# EasyEDA Pro project 24Vto12V_v2_1_2025-04-05_21-50-08.eprj

# Schematic Schematic1
Board Name: Board1; Create Date: 2025-04-05; Page Name: P1; Project Name: 24Vto12V_v2_1_2025-04-05_21-50-08; Schematic Name: Schematic1; Update Date: 2025-04-05; Company: 嘉立创EDA; Drawed: 王大智; Page Size: A4; Version: V1.0
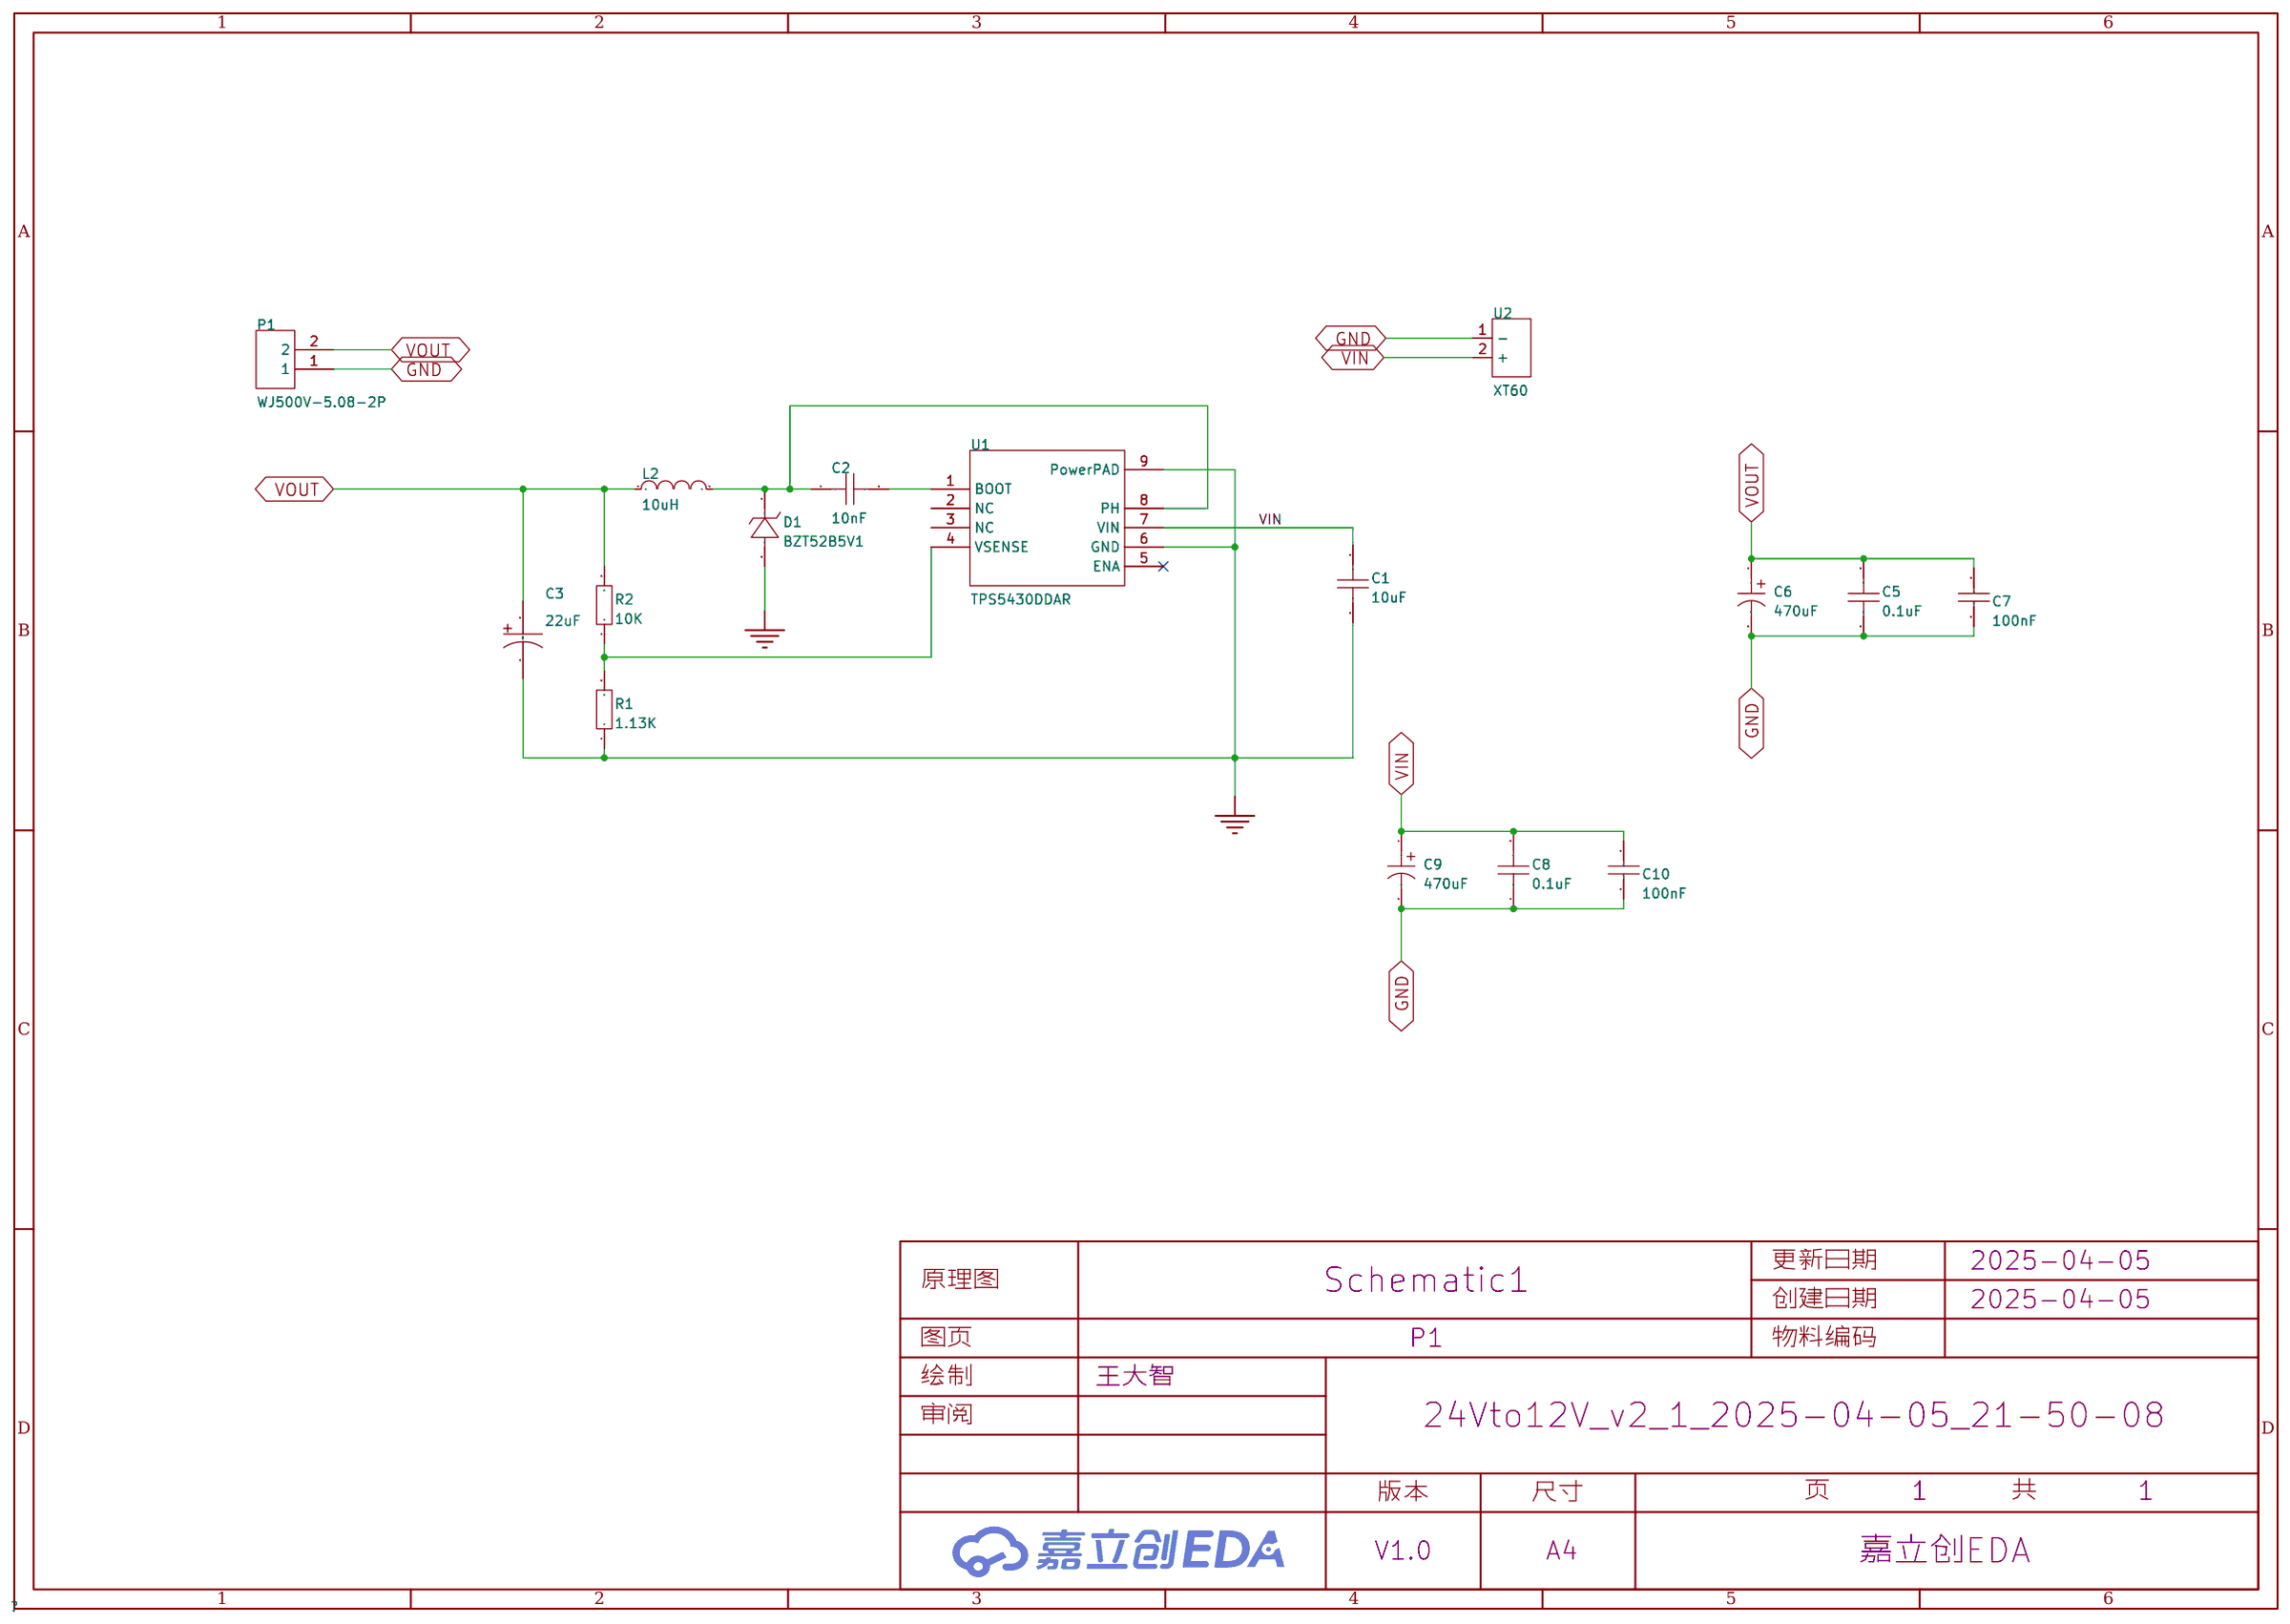
[diagram p0: schematic sheet]

## Parts
C1  10uF  [C0603]
C2  10nF  [C0603]
C3  22uF  [CAP-SMD_L3.5-W2.8-R-RD]
C5  0.1uF  [C0603]
C6  470uF  [CAP-TH_BD8.0-P3.50-D0.6-FD_1]
C7  100nF  [CAP-TH_L8.5-W5.0-P5.00-D1.2]
C8  0.1uF  [C0603]
C9  470uF  [CAP-TH_BD8.0-P3.50-D0.6-FD_1]
C10  100nF  [CAP-TH_L8.5-W5.0-P5.00-D1.2]
D1  BZT52B5V1  [SOD-123_L2.7-W1.6-LS3.7-RD]
L2  10uH  [IND-SMD_L11.5-W10.0_MCF-1050]
P1  WJ500V-5.08-2P  [CONN-TH_2P-P5.00_WJ500V-5.08-2P]
R1  1.13K  [R0603]
R2  10K  [R0603]
U1  TPS5430DDAR  [ESOP-8_L4.9-W3.9-P1.27-LS6.0-TL-EP]
U2  XT60  [CONN-TH_XT60]

## Library data of the parts
C1 C2 C5 C8 = CAP_0603: Supplier Footprint: 0603
C3 = TPSB226K020R0400: 容值:22uF;精度:±10%;额定电压:20V;等效串联电阻:400mΩ@100kHz;; LCSC Part Name: 22uF ±10% 20V; Supplier Part: C308917; Manufacturer: Kyocera AVX; Supplier Footprint: CASE-B-3528-21(mm); JLCPCB Part Class: 扩展库; Datasheet: https://atta.szlcsc.com/upload/public/pdf/source/20190626/C400103_28AE209020E7532C1D8166E9B4B580CB.pdf; Supplier: LCSC; Tolerance: ±10%; Rated Voltage: 20V; Equivalent Series Resistance(ESR): 400mΩ@100kHz; Operating Temperature: -55℃~+125℃
C6 C9 = CD2884771EM0812VFL: 容值:470uF;额定电压:25V;; LCSC Part Name: 470uF 25V; Supplier Part: C2960233; Manufacturer: HRK(鸿瑞凯电子); Supplier Footprint: 插件,D8xL12mm; JLCPCB Part Class: 扩展库; Datasheet: https://atta.szlcsc.com/upload/public/pdf/source/20240703/D49961C1CEC6E325964F7113D69E9087.pdf; Supplier: LCSC; Rated Voltage: 25V; φD: 8mm; L: 12mm; Operating Temperature: -40℃~+105℃
C7 C10 = CT4-0805Y104M500F3: 容值:100nF;精度:±20%;额定电压:50V;温度系数:Y5V;; LCSC Part Name: 100nF ±20% 50V; Supplier Part: C94717; Manufacturer: FH(风华); Supplier Footprint: 插件,P=5.08mm; JLCPCB Part Class: 扩展库; Datasheet: https://atta.szlcsc.com/upload/public/pdf/source/20190402/C385200_059806A6312B28FF1421A2413EB641E1.pdf; Supplier: LCSC; Tolerance: ±20%; Voltage Rated: 50V; Temperature Coefficient: Y5V
D1 = BZT52B5V1_C19077393: 二极管配置:独立式;稳压值(标称值):5.1V;稳压值(范围):5V~5.2V;耗散功率(Pd):500mW;; Supplier Part: C19077393; Manufacturer: 宏嘉诚; Supplier Footprint: SOD-123; JLCPCB Part Class: 扩展库; Datasheet: https://atta.szlcsc.com/upload/public/pdf/source/20250106/AFD01FE5B0C707EDCEE558C585303F64.pdf; Supplier: LCSC; Diode Configuration: 独立式; Zener Voltage(Nom): 5.1V; Reverse Leakage Current (Ir): 2uA@2V; Zener Voltage(Range): 5V~5.2V; Pd - Power Dissipation(Pd): 500mW; Impedance(Zzt): 60Ω
L2 = MS1040-100M: LCSC Part Name: 10uH ±20%; Supplier Part: C380052; Manufacturer: COILMX(迈翔科技); Supplier Footprint: SMD; JLCPCB Part Class: 扩展库; Datasheet: https://atta.szlcsc.com/upload/public/pdf/source/20190509/C380060_C480BF6C9DDC75EDE5BB1ABE1C0858F7.pdf; Supplier: LCSC; Tolerance: ±20%; Rated Current: 5.5A; DC Resistance (DCR): 27mΩ
P1 = WJ500V-5.08-2P: 结构:1x2P;间距:5.08mm;颜色:绿色;安装方式:直插;额定电流:18A;额定电压:250V;排数:1;线规 - AWG:14~30;线规 - 平方毫米:2.5;每排PIN数:2;触头材质:-;触头镀层:-;工作温度范围:-40℃~+105℃;焊接温度(最大值):-;; LCSC Part Name: 1x2P 5.08mm 直插 排数:1 每排P数:2; Supplier Part: C8465; Manufacturer: KANGNEX(康奈克斯电气); Supplier Footprint: 插件,P=5.08mm; JLCPCB Part Class: 扩展库; Datasheet: https://atta.szlcsc.com/upload/public/pdf/source/20191225/C8465_02D34CE5B5B4A53DF5891601D97FA9F4.pdf; Supplier: LCSC; Structure: 1x2P; Pitch: 5.08mm; Color: 绿色; Mounting Style: 直插; Current Rating (Max): 18A; Voltage Rating (Max): 250V; Number of Pins: 2P; Number of Rows: 1; Wire Gauge - AWG: 14~30; Wire Gauge - mm2: 2.5; Number of PINs Per Row: 2; Operating Temperature Range: -40℃~+105℃; Screw Specification: M2.5
R1 R2 = Res_0603: Supplier Footprint: 0603
U1 = TPS5430DDAR: 功能类型:降压型;输出类型:可调;工作电压:5.5V~36V;输出电压:1.221V~32.04V;输出电流:3A;; LCSC Part Name: 宽输入范围、3A输出电流的降压转换器; Supplier Part: C9864; Manufacturer: TI(德州仪器); Supplier Footprint: SOIC-8-EP; JLCPCB Part Class: 基础库; Datasheet: https://www.ti.com/cn/lit/gpn/tps5430; Supplier: LCSC; Function: 降压型; Output Type: 可调; Input Voltage: 5.5V~36V; Output Voltage: 1.221V~32.04V; Output Current: 3A; Switching Frequency: 500kHz; Operating Temperature: -40℃~+125℃@(TJ); Synchronous Rectification: 否; Number of Outputs: 1; Topology: 降压式; Switch tube (built-in/external): 内置
U2 = XT60: 类别:-;类型1:-;; LCSC Part Name: AMASS(艾迈斯) XT60模型插头 3.5mm镀金香蕉头公头（电调端）XT60-M; Supplier Part: C98733; Manufacturer: AMASS(艾迈斯); JLCPCB Part Class: 扩展库; Datasheet: https://atta.szlcsc.com/upload/public/pdf/source/20170606/1496716524919.pdf; Supplier: LCSC; Brand: 艾迈斯; Type: 香蕉头; Colour: 黄色; InterfaceType: 公头; specifications: 3.5mm

## Nets
GND: C1.1 C3.2 C5.1 C6.2 C7.1 C8.1 C9.2 C10.1 D1.2(A) P1.1 R1.1 U1.6(GND) U1.9(PowerPAD) U2.1(-)
VIN: C1.2 C8.2 C9.1 C10.2 U1.7(VIN) U2.2(+)
VOUT: C3.1 C5.2 C6.1 C7.2 L2.1 P1.2 R2.2
$1N699: C2.2 U1.1(BOOT)
$1N700: C2.1 D1.1(K) L2.2 U1.8(PH)
$1N702: R1.2 R2.1 U1.4(VSENSE)

Not connected (* = marked no-connect by the designer): U1 2(NC) 3(NC) 5(ENA)*

# Board PCB1
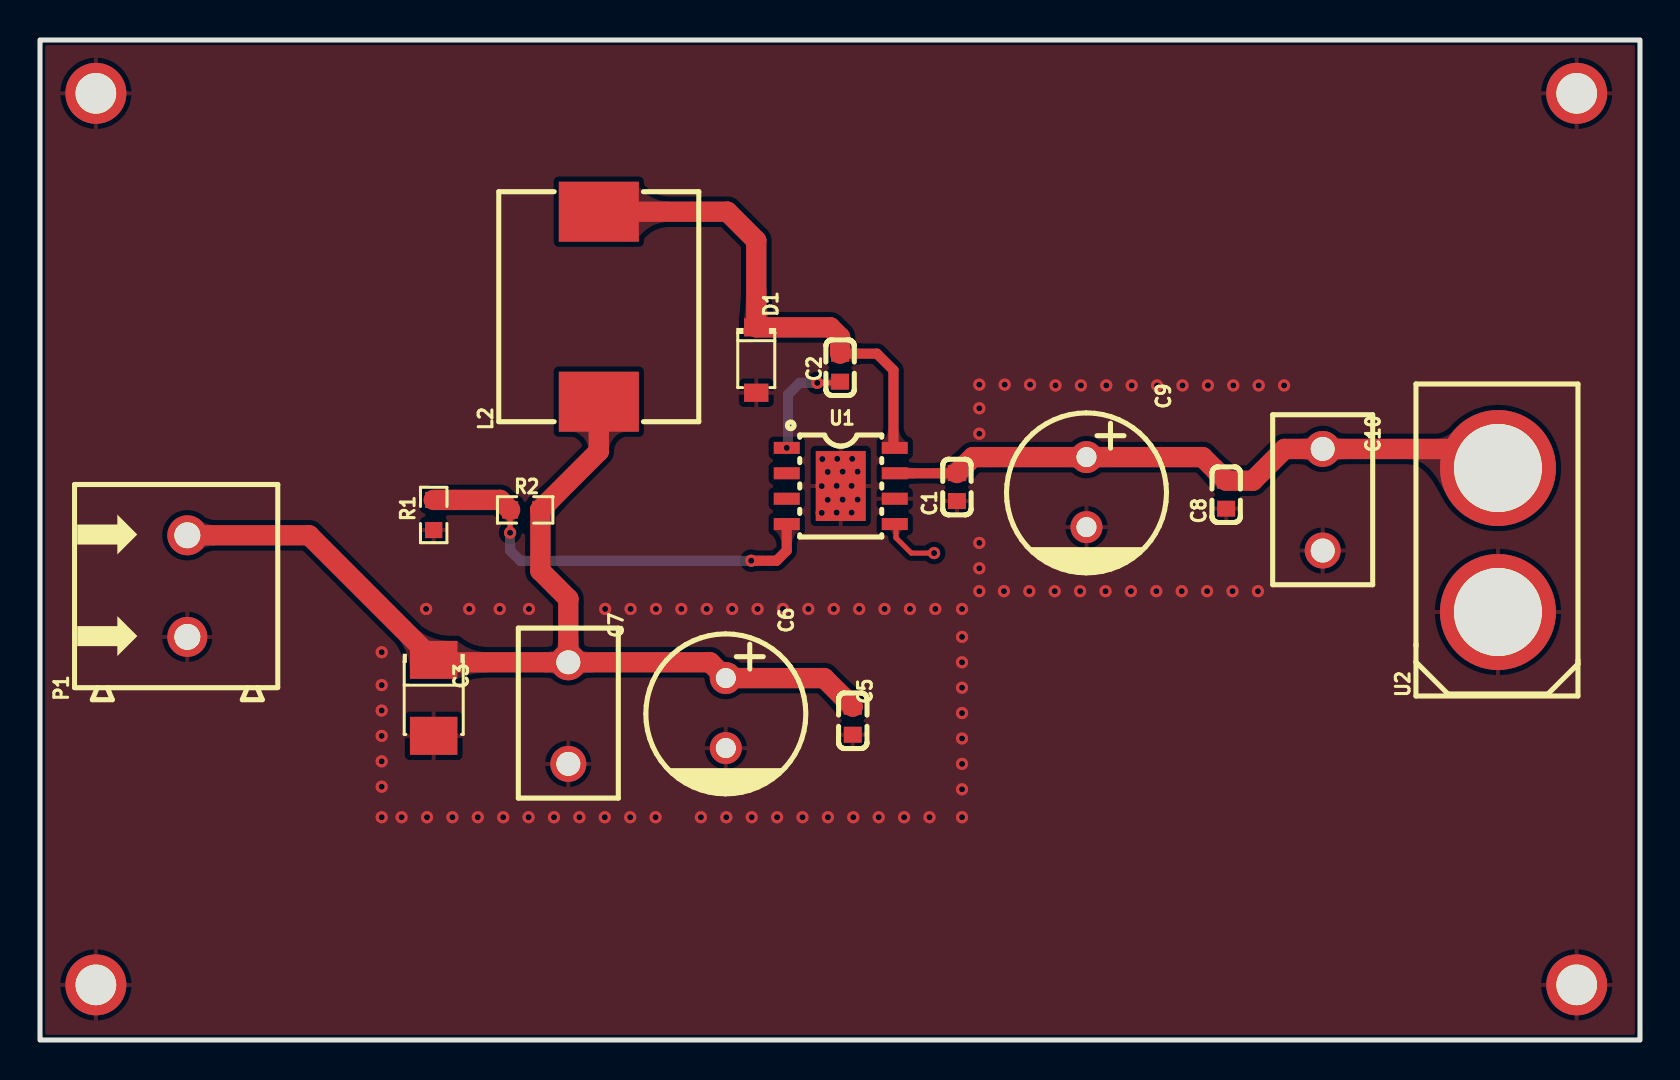
[diagram p1: board, top side]
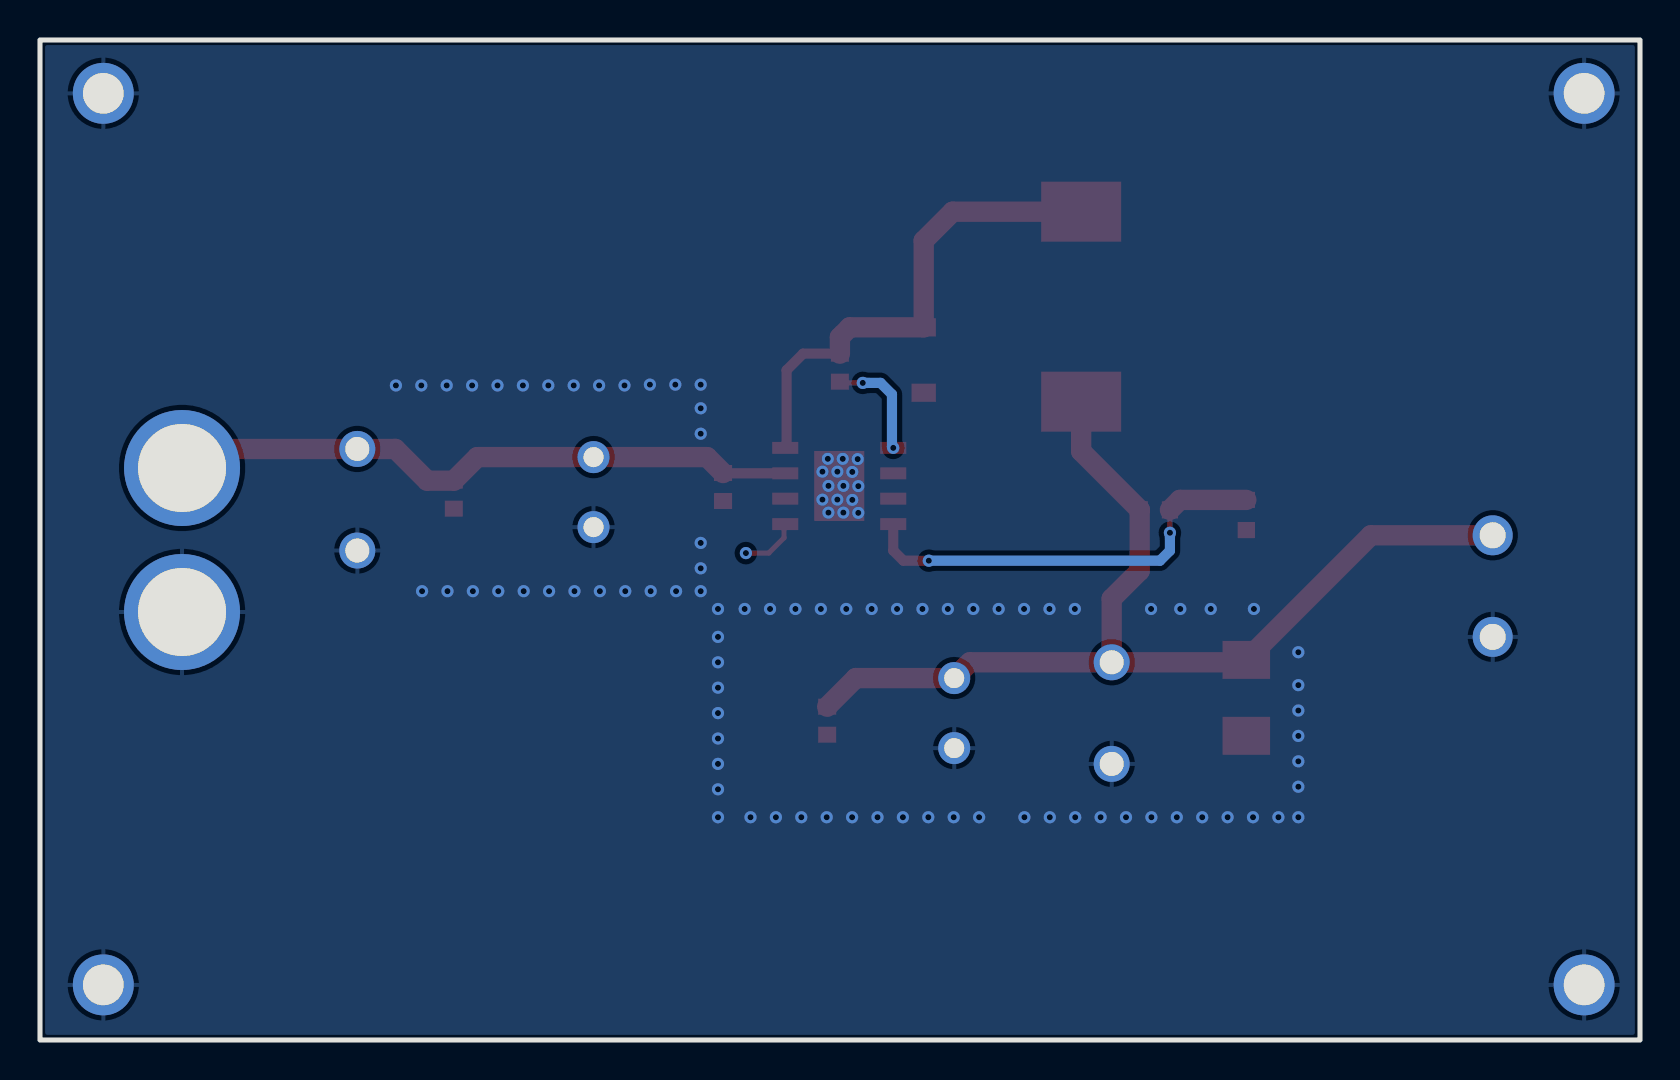
[diagram p2: board, bottom side, seen from below]

Outline 80 x 50 mm; copper layers: Top Layer, Bottom Layer. Coordinates in mm from the lower left corner of the outline.
Outline path: rectangle 0,50 80,0
Stack: Top Layer 0.035mm / Dielectric1 1.51mm FR4 er 4.5 / Bottom Layer 0.035mm

## Design rules (mm)
template: JLCPCB Capability(Two Layers Board)
spacing copperThickness1oz (default): track to track 0.102, other pairs 0.152 to 0.3
spacing copperThickness2oz: track to track 0.203, other pairs 0.152 to 0.3
track width copperThickness1oz (default): min 0.127, default 0.254, max 2.54
track width copperThickness2oz: min 0.203, default 0.254, max 2.54
differential pair differentialPair (default): width min 0.127, default 0.254, max 2.54; gap min 0.152, default 0.152
via viaSize (default): diameter min 0.5, default 0.61, max 10; hole min 0.3, default 0.305, max 6.3

## Placement (name value [footprint] x y rotation side)
C1  10uF  [C0603]  45.85 27.65 90 top
C2  10nF  [C0603]  40.01 33.62 270 top
C3  22uF  [CAP-SMD_L3.5-W2.8-R-RD]  19.69 17.11 90 top
C5  0.1uF  [C0603]  40.64 15.96 90 top
C6  470uF  [CAP-TH_BD8.0-P3.50-D0.6-FD_1]  34.29 16.34 270 top
C7  100nF  [CAP-TH_L8.5-W5.0-P5.00-D1.2]  26.42 16.34 90 top
C8  0.1uF  [C0603]  59.31 27.27 90 top
C9  470uF  [CAP-TH_BD8.0-P3.50-D0.6-FD_1]  52.32 27.39 270 top
C10  100nF  [CAP-TH_L8.5-W5.0-P5.00-D1.2]  64.14 27.01 90 top
D1  BZT52B5V1  [SOD-123_L2.7-W1.6-LS3.7-RD]  35.81 34 270 top
L2  10uH  [IND-SMD_L11.5-W10.0_MCF-1050]  27.94 36.67 90 top
NOREF  -  [Pad_e412]  76.83 2.76 0 top
NOREF#2  -  [Pad_e411]  2.79 2.76 0 top
NOREF#3  -  [Pad_e404]  2.79 47.33 0 top
NOREF#4  -  [Pad_e410]  76.83 47.33 0 top
P1  WJ500V-5.08-2P  [CONN-TH_2P-P5.00_WJ500V-5.08-2P]  7.37 22.7 90 top
R1  1.13K  [R0603]  19.69 26.25 90 top
R2  10K  [R0603]  24.26 26.51 0 top
U1  TPS5430DDAR  [ESOP-8_L4.9-W3.9-P1.27-LS6.0-TL-EP]  40.04 27.7 0 top
U2  XT60  [CONN-TH_XT60]  72.9 25 90 top

## Footprints (pads in the part's own frame, mm; a bottom-side part is the same pattern mirrored in y, then rotated)
C0603
  rect 0.8x0.9 smd: 1(-0.7,0) 2(0.7,0)
CAP-SMD_L3.5-W2.8-R-RD
  rect 1.9x2.376 smd: 1(1.899,0) 2(-1.899,0)
CAP-TH_BD8.0-P3.50-D0.6-FD_1
  round 1.6 hole 1: 1(-1.75,0) 2(1.75,0)
CAP-TH_L8.5-W5.0-P5.00-D1.2
  round 1.8 hole 1.2: 1(-2.54,0) 2(2.54,0)
CONN-TH_2P-P5.00_WJ500V-5.08-2P
  round 2 hole 1.3: 1(-2.54,0) 2(2.54,0)
CONN-TH_XT60
  round 5.8 hole 4.4: 1(-3.6,0) 2(3.6,0)
ESOP-8_L4.9-W3.9-P1.27-LS6.0-TL-EP
  rect 1.3x0.6 smd: 1(-2.7,1.905) 2(-2.7,0.635) 3(-2.7,-0.635) 4(-2.7,-1.905) 5(2.7,-1.905) 6(2.7,-0.635) 7(2.7,0.635) 8(2.7,1.905)
  rect 2.5x3.5 smd: 9(0,0)
IND-SMD_L11.5-W10.0_MCF-1050
  rect 3x4 smd: 1(-4.75,0) 2(4.75,0)
Pad_e404
  round 3.048 hole 2.032: 1(0,0)
Pad_e410
  round 3.048 hole 2.032: 1(0,0)
Pad_e411
  round 3.048 hole 2.032: 1(0,0)
Pad_e412
  round 3.048 hole 2.032: 1(0,0)
R0603
  rect 0.806x0.864 smd: 1(-0.753,0) 2(0.753,0)
SOD-123_L2.7-W1.6-LS3.7-RD
  rect 0.91x1.22 smd: 1(-1.635,0) 2(1.635,0)

## Nets
As in the schematic, except:
GND: C1.1 C3.2 C5.1 C6.2 C7.1 C8.1 C9.2 C10.1 D1.2 NOREF.1 NOREF#2.1 NOREF#3.1 NOREF#4.1 P1.1 R1.1 U1.6 U1.9 U2.1

Pads without a net: U1 2 3

## Via types
v1: diameter 0.61, hole 0.305, Top Layer to Bottom Layer, 104 vias

## Routing (per net, layer and track width the routed paths; a pad name or vN(x,y) marks a point on that pad's centre or on a via; arc(x,y) is an arc through that point)
GND:
  vias: v1(17.08,19.39) v1(17.08,17.74) v1(17.08,16.47) v1(17.08,15.2) v1(17.08,13.93) v1(17.08,12.66) v1(17.08,11.14) v1(18.08,11.14) v1(19.3,21.55) v1(19.35,11.14) v1(20.62,11.14) v1(21.46,21.55) v1(21.89,11.14) v1(22.99,21.55) v1(23.16,11.14) v1(24.45,21.55) v1(24.43,11.14) v1(25.7,11.14) v1(26.97,11.14) v1(28.26,21.55) v1(28.24,11.14) v1(29.53,21.55) v1(29.51,11.14) v1(30.8,21.55) v1(30.78,11.14) v1(32.07,21.55) v1(33.05,11.14) v1(33.34,21.55) v1(34.32,11.14) v1(34.61,21.55) v1(35.58,11.14) v1(35.88,21.55) v1(36.86,11.14) v1(37.15,21.55) v1(38.13,11.14) v1(38.42,21.55) v1(39.09,27.69) v1(39.09,26.36) v1(39.12,29.05) v1(39.39,28.4) v1(39.39,27.01) v1(39.39,11.14) v1(39.69,21.55) v1(39.86,29.06) v1(39.83,27.71) v1(39.83,26.37) v1(40.13,28.42) v1(40.13,27.02) v1(40.58,27.71) v1(40.58,26.37) v1(40.61,29.06) v1(40.67,11.14) v1(40.88,28.42) v1(40.88,27.02) v1(40.96,21.55) v1(41.94,11.14) v1(42.23,21.55) v1(43.2,11.14) v1(43.5,21.55) v1(44.48,11.14) v1(44.77,21.55) v1(46.1,21.55) v1(46.1,20.16) v1(46.1,18.89) v1(46.1,17.62) v1(46.1,16.34) v1(46.1,15.08) v1(46.1,13.81) v1(46.1,12.53) v1(46.1,11.14) v1(46.97,32.77) v1(46.97,31.59) v1(46.97,30.31) v1(46.97,24.85) v1(46.97,23.58) v1(46.97,22.44) v1(48.2,22.44) v1(48.23,32.77) v1(49.47,22.44) v1(49.51,32.77) v1(50.77,32.73) v1(50.74,22.44) v1(52.05,32.73) v1(52.01,22.44) v1(53.28,22.44) v1(53.32,32.73) v1(54.58,32.73) v1(54.55,22.44) v1(55.86,32.73) v1(55.82,22.44) v1(57.09,22.44) v1(57.13,32.73) v1(58.39,32.73) v1(58.36,22.44) v1(59.67,32.73) v1(59.63,22.44) v1(60.9,22.44) v1(60.94,32.73) v1(62.2,32.73)
VIN: length 32
  Top Layer w0.508: U1.7 45.83,28.34
  Top Layer w1.016: U2.2 71.95,29.55 C10.2 62.23,29.55 60.64,27.97 C8.2 58.13,29.14 C9.1 46.64,29.14 C1.2
ENA: length 2.9
  Top Layer w0.254: U1.5 42.8,25.73 42.8,25.11 43.56,24.35 v1(44.7,24.35)
VOUT: length 51.6
  Top Layer w1.016: C7.2 26.42,22.06 25.02,23.46 25.02,26.5 R2.2 27.94,29.43 L2.1 ; C7.2 33.5,18.89 C6.1 39.21,18.09 C5.2 ; C7.2 19.81,18.89 C3.1 13.46,25.23 P1.2
$1N699: length 5.6
  Top Layer w0.254: C2.2 39.94,32.86 v1(38.86,32.86)
  Bottom Layer w0.508: v1(38.86,32.86) 37.97,32.86 37.4,32.28 37.4,29.67 v1(37.34,29.61)
$1N700: length 24.9
  Top Layer w0.508: U1.8 42.67,29.67 42.67,33.49 41.85,34.32 C2.1
  Top Layer w1.016: C2.1 40.01,35.14 39.51,35.63 D1.1 35.81,39.97 34.37,41.42 L2.2
$1N702: length 21.6
  Top Layer w0.254: R2.1 v1(23.5,25.36)
  Top Layer w0.508: U1.4 37.34,24.47 36.83,23.97 v1(35.56,23.97)
  Top Layer w1.016: R1.2 23,27 R2.1
  Bottom Layer w0.508: v1(35.56,23.97) 24,23.97 23.5,24.46 v1(23.5,25.36)

## Copper pours and planes (outline as drawn; the poured copper is in the pictures)
GND on Top Layer: -5.21,55.33 85.85,55.33 85.85,-5.63 -5.21,-5.63
GND on Bottom Layer: -8.64,56.98 90.55,56.98 90.55,-9.06 -8.64,-9.06

Small or netless copper shapes (teardrops, artwork), in the pictures only: 32 on Top Layer, 4 on Bottom Layer
